# EAGLE schematic tinynumitronboard-extended (EAGLE 6.3)
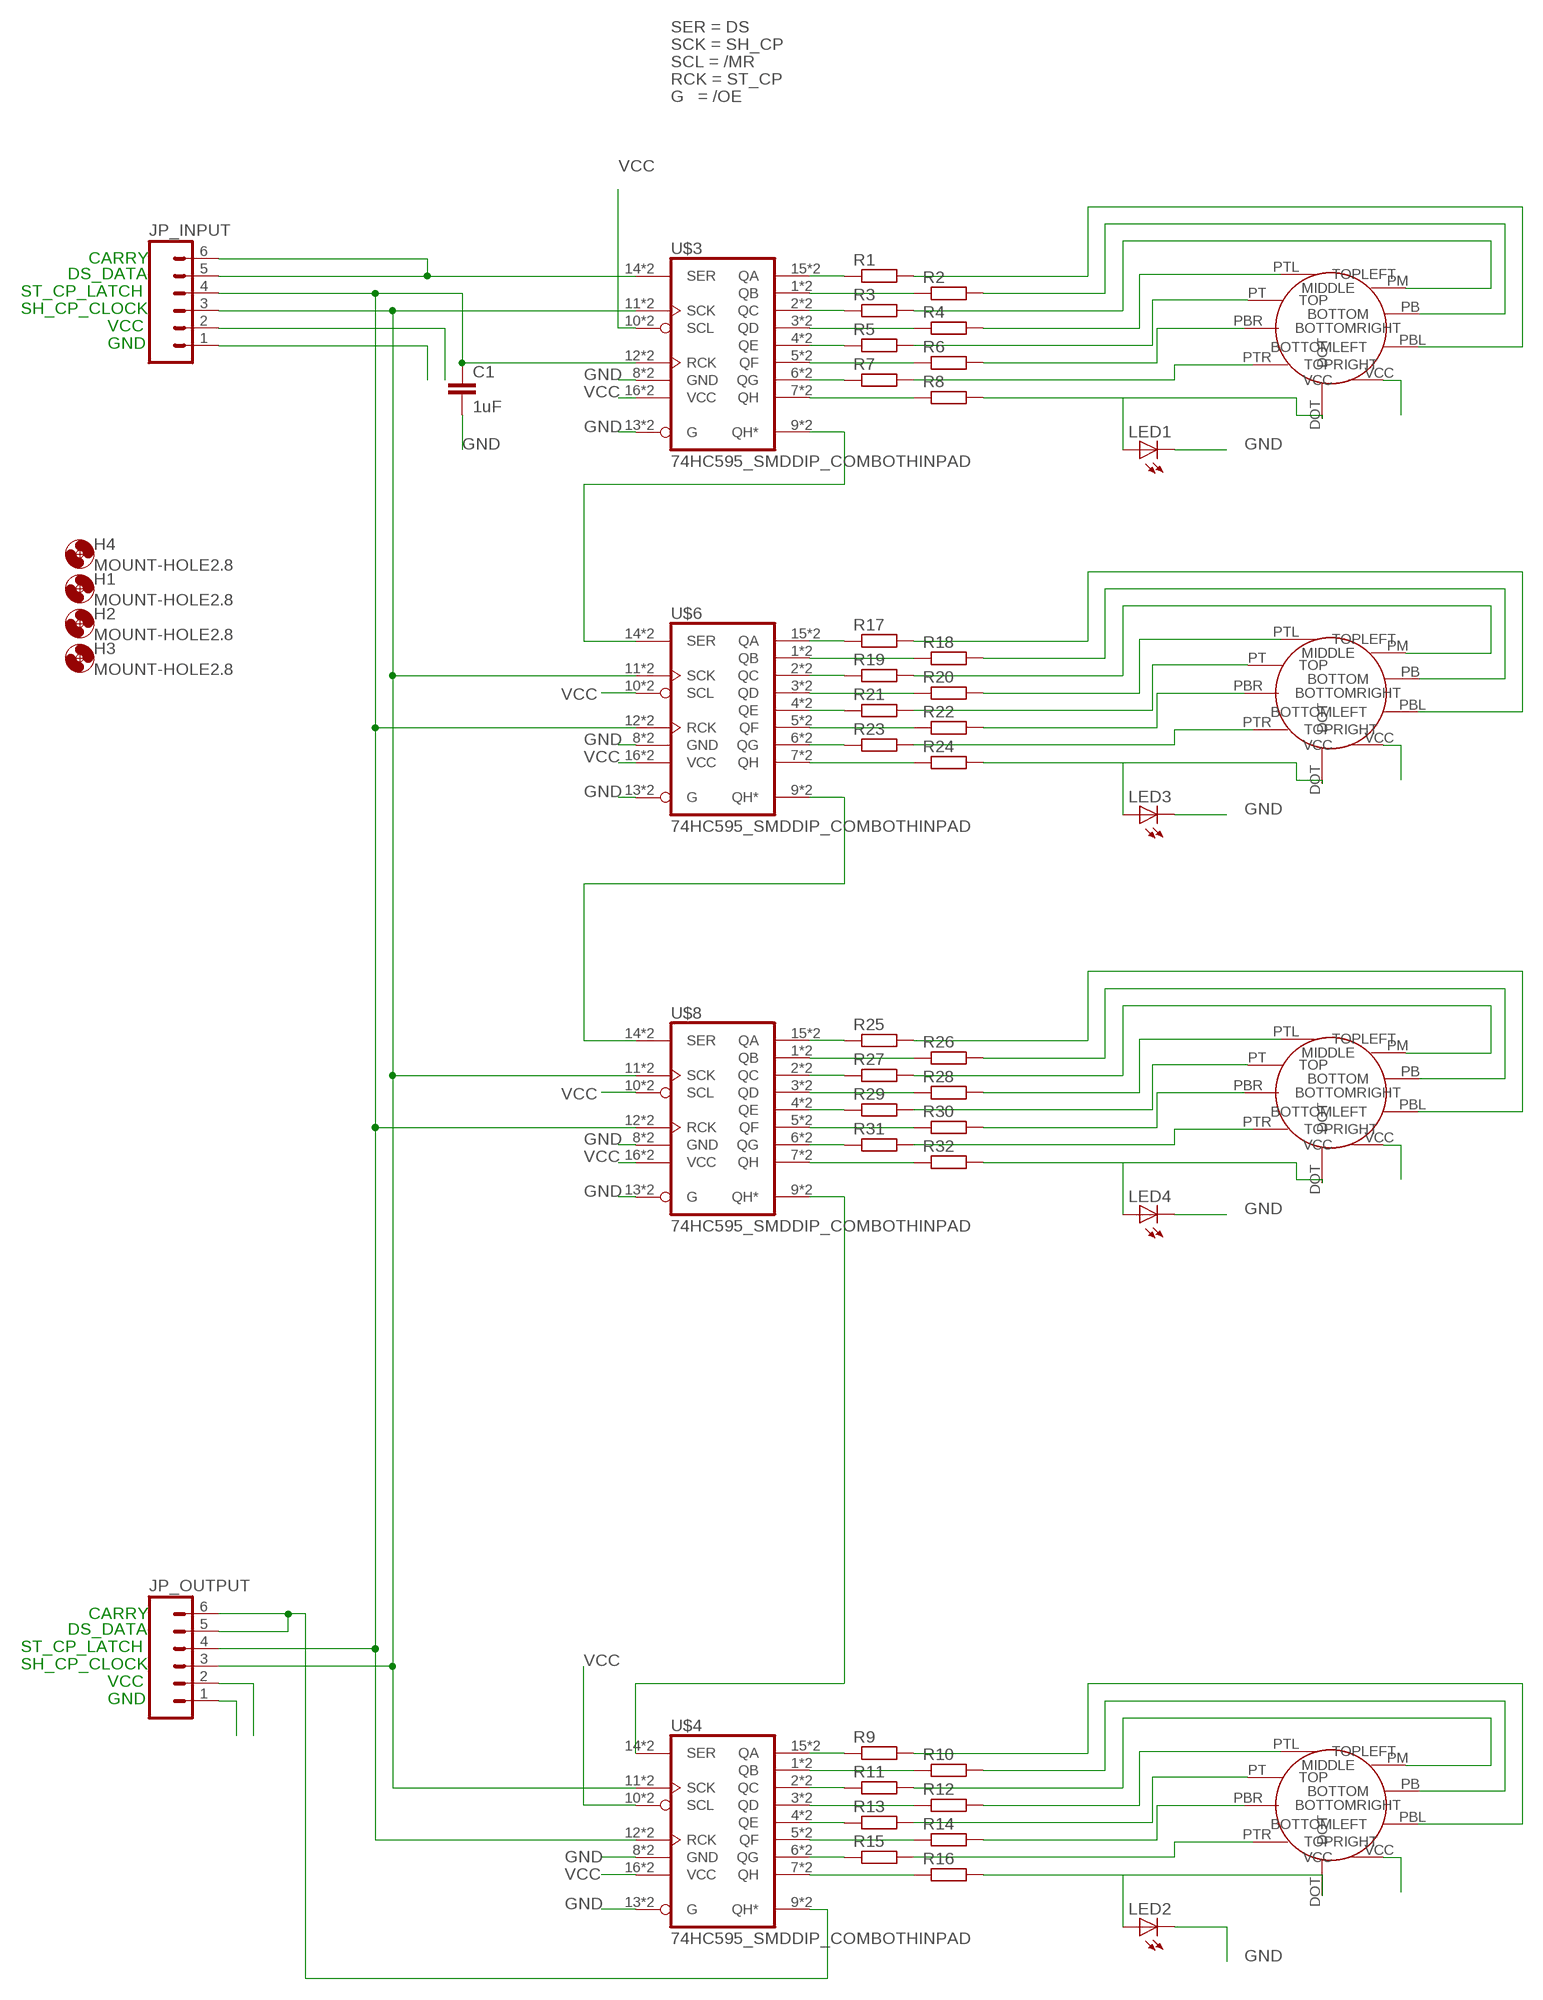
[diagram p0: schematic, sheet 1]

## Parts
C1  1uF  C-EU050-024X044  [C050-024X044]
H1  MOUNT-HOLE2.8  [2,8]
H2  MOUNT-HOLE2.8  [2,8]
H3  MOUNT-HOLE2.8  [2,8]
H4  MOUNT-HOLE2.8  [2,8]
JP_INPUT  M06SIP  [1X06]
JP_OUTPUT  M06SIP  [1X06]
LED1  LEDKA-3528ASYC  [KA-3528ASYC]
LED2  LEDKA-3528ASYC  [KA-3528ASYC]
LED3  LEDKA-3528ASYC  [KA-3528ASYC]
LED4  LEDKA-3528ASYC  [KA-3528ASYC]
R1  R-EU_0207/10  [0207/10]
R2  R-EU_0207/10  [0207/10]
R3  R-EU_0207/10  [0207/10]
R4  R-EU_0207/10  [0207/10]
R5  R-EU_0207/10  [0207/10]
R6  R-EU_0207/10  [0207/10]
R7  R-EU_0207/10  [0207/10]
R8  R-EU_0207/10  [0207/10]
R9  R-EU_0207/10  [0207/10]
R10  R-EU_0207/10  [0207/10]
R11  R-EU_0207/10  [0207/10]
R12  R-EU_0207/10  [0207/10]
R13  R-EU_0207/10  [0207/10]
R14  R-EU_0207/10  [0207/10]
R15  R-EU_0207/10  [0207/10]
R16  R-EU_0207/10  [0207/10]
R17  R-EU_0207/10  [0207/10]
R18  R-EU_0207/10  [0207/10]
R19  R-EU_0207/10  [0207/10]
R20  R-EU_0207/10  [0207/10]
R21  R-EU_0207/10  [0207/10]
R22  R-EU_0207/10  [0207/10]
R23  R-EU_0207/10  [0207/10]
R24  R-EU_0207/10  [0207/10]
R25  R-EU_0207/10  [0207/10]
R26  R-EU_0207/10  [0207/10]
R27  R-EU_0207/10  [0207/10]
R28  R-EU_0207/10  [0207/10]
R29  R-EU_0207/10  [0207/10]
R30  R-EU_0207/10  [0207/10]
R31  R-EU_0207/10  [0207/10]
R32  R-EU_0207/10  [0207/10]
U$1  IV16TINY_NUMITRON  [IV16TINY_NUMITRON_PAC]
U$2  IV16TINY_NUMITRON  [IV16TINY_NUMITRON_PAC]
U$3  74HC595_SMDDIP_COMBOTHINPAD  [DIL16_SO16_PAC2]
U$4  74HC595_SMDDIP_COMBOTHINPAD  [DIL16_SO16_PAC2]
U$5  IV16TINY_NUMITRON  [IV16TINY_NUMITRON_PAC]
U$6  74HC595_SMDDIP_COMBOTHINPAD  [DIL16_SO16_PAC2]
U$7  IV16TINY_NUMITRON  [IV16TINY_NUMITRON_PAC]
U$8  74HC595_SMDDIP_COMBOTHINPAD  [DIL16_SO16_PAC2]

## Nets
GND: C1.2 JP_INPUT.1 JP_OUTPUT.1 LED1.C LED2.C LED3.C LED4.C U$4.8(GND) U$4.13(G) U$4.S8(GND) U$4.S13(G)
N$1: R1.2 U$1.PBL(BOTTOMLEFT)
N$2: R2.2 U$1.PB(BOTTOM)
N$3: R3.2 U$1.PM(MIDDLE)
N$4: R4.2 U$1.PTL(TOPLEFT)
N$5: R5.2 U$1.PT(TOP)
N$6: R6.2 U$1.PBR(BOTTOMRIGHT)
N$7: R7.2 U$1.PTR(TOPRIGHT)
N$8: R1.1 U$3.15(QA) U$3.S15(QA)
N$9: R2.1 U$3.1(QB) U$3.S1(QB)
N$10: R3.1 U$3.2(QC) U$3.S2(QC)
N$11: R4.1 U$3.3(QD) U$3.S3(QD)
N$12: R5.1 U$3.4(QE) U$3.S4(QE)
N$13: R6.1 U$3.5(QF) U$3.S5(QF)
N$14: R7.1 U$3.6(QG) U$3.S6(QG)
N$15: JP_INPUT.5 JP_INPUT.6
N$16: R8.1 U$3.7(QH) U$3.S7(QH)
N$17: LED1.A R8.2 U$1.DOT
N$18: C1.1 JP_INPUT.4 JP_OUTPUT.4 U$4.12(RCK) U$4.S12(RCK)
N$19: JP_INPUT.3 JP_OUTPUT.3 U$4.11(SCK) U$4.S11(SCK)
N$20: R9.2 U$2.PBL(BOTTOMLEFT)
N$21: R10.2 U$2.PB(BOTTOM)
N$22: JP_OUTPUT.5 JP_OUTPUT.6 U$4.9(QH*) U$4.S9(QH*)
N$24: R11.2 U$2.PM(MIDDLE)
N$25: R12.2 U$2.PTL(TOPLEFT)
N$26: R13.2 U$2.PT(TOP)
N$27: R14.2 U$2.PBR(BOTTOMRIGHT)
N$28: R15.2 U$2.PTR(TOPRIGHT)
N$29: R9.1 U$4.15(QA) U$4.S15(QA)
N$30: R10.1 U$4.1(QB) U$4.S1(QB)
N$31: R11.1 U$4.2(QC) U$4.S2(QC)
N$32: R12.1 U$4.3(QD) U$4.S3(QD)
N$33: R13.1 U$4.4(QE) U$4.S4(QE)
N$34: R14.1 U$4.5(QF) U$4.S5(QF)
N$35: R15.1 U$4.6(QG) U$4.S6(QG)
N$36: R16.1 U$4.7(QH) U$4.S7(QH)
N$37: LED2.A R16.2 U$2.DOT
N$39: R17.2 U$5.PBL(BOTTOMLEFT)
N$40: R18.2 U$5.PB(BOTTOM)
N$41: R19.2 U$5.PM(MIDDLE)
N$42: R20.2 U$5.PTL(TOPLEFT)
N$43: R21.2 U$5.PT(TOP)
N$44: R22.2 U$5.PBR(BOTTOMRIGHT)
N$45: R23.2 U$5.PTR(TOPRIGHT)
N$46: R17.1 U$6.15(QA) U$6.S15(QA)
N$47: R18.1 U$6.1(QB) U$6.S1(QB)
N$48: R19.1 U$6.2(QC) U$6.S2(QC)
N$49: R20.1 U$6.3(QD) U$6.S3(QD)
N$50: R21.1 U$6.4(QE) U$6.S4(QE)
N$51: R22.1 U$6.5(QF) U$6.S5(QF)
N$52: R23.1 U$6.6(QG) U$6.S6(QG)
N$53: R24.1 U$6.7(QH) U$6.S7(QH)
N$54: LED3.A R24.2 U$5.DOT
N$62: R25.2 U$7.PBL(BOTTOMLEFT)
N$63: R26.2 U$7.PB(BOTTOM)
N$64: R27.2 U$7.PM(MIDDLE)
N$65: R28.2 U$7.PTL(TOPLEFT)
N$66: R29.2 U$7.PT(TOP)
N$67: R30.2 U$7.PBR(BOTTOMRIGHT)
N$68: R31.2 U$7.PTR(TOPRIGHT)
N$69: R25.1 U$8.15(QA) U$8.S15(QA)
N$70: R26.1 U$8.1(QB) U$8.S1(QB)
N$71: R27.1 U$8.2(QC) U$8.S2(QC)
N$72: R28.1 U$8.3(QD) U$8.S3(QD)
N$73: R29.1 U$8.4(QE) U$8.S4(QE)
N$74: R30.1 U$8.5(QF) U$8.S5(QF)
N$75: R31.1 U$8.6(QG) U$8.S6(QG)
N$76: R32.1 U$8.7(QH) U$8.S7(QH)
N$77: LED4.A R32.2 U$7.DOT
N$78: U$4.14(SER) U$4.S14(SER)
VCC: JP_INPUT.2 JP_OUTPUT.2 U$1.VCC U$2.VCC U$4.10(SCL) U$4.16(VCC) U$4.S10(SCL) U$4.S16(VCC) U$5.VCC U$7.VCC
Unconnected: U$3.9(QH*) U$3.10(SCL) U$3.11(SCK) U$3.12(RCK) U$3.13(G) U$3.14(SER) U$3.S9(QH*) U$3.S10(SCL) U$3.S11(SCK) U$3.S12(RCK) U$3.S13(G) U$3.S14(SER) U$6.9(QH*) U$6.10(SCL) U$6.11(SCK) U$6.12(RCK) U$6.13(G) U$6.14(SER) U$6.S9(QH*) U$6.S10(SCL) U$6.S11(SCK) U$6.S12(RCK) U$6.S13(G) U$6.S14(SER) U$8.9(QH*) U$8.10(SCL) U$8.11(SCK) U$8.12(RCK) U$8.13(G) U$8.14(SER) U$8.S9(QH*) U$8.S10(SCL) U$8.S11(SCK) U$8.S12(RCK) U$8.S13(G) U$8.S14(SER)

## Notes on the sheet
- SER = DS
- SCK = SH_CP
- SCL = /MR
- RCK = ST_CP
- G   = /OE
- CARRY
- DS_DATA
- ST_CP_LATCH
- SH_CP_CLOCK
- VCC
- GND
- CARRY
- DS_DATA
- ST_CP_LATCH
- SH_CP_CLOCK
- VCC
- GND

## Power pins joined to a net without a drawn wire
GND: U$3.8(GND) U$3.S8(GND) U$6.8(GND) U$6.S8(GND) U$8.8(GND) U$8.S8(GND)
VCC: U$3.16(VCC) U$3.S16(VCC) U$6.16(VCC) U$6.S16(VCC) U$8.16(VCC) U$8.S16(VCC)

## Library data of the parts
C1 = resistor:C-EU: CAPACITOR, European symbol
H1-H4 = holes:MOUNT-HOLE: MOUNTING HOLE with drill center marker
JP_INPUT JP_OUTPUT = SparkFun:M06: Header 6 Standard 6-pin 0.1" header. Use with straight break away headers (SKU : PRT-00116), right angle break away headers (PRT-00553), swiss pins (PRT-00743), machine pins (PRT-00117), and female headers (PRT-00115). Molex polarized connector foot print use with SKU : PRT-08094 with associated crimp pins and housings. NOTES ON THE VARIANTS LOCK and LOCK_LONGPADS... This footprint was designed to help hold the alignment of a through-hole component (i.e. 6-pin header) while soldering it into place. You may notice that each hole has been shifted either up or down by 0.005 of an inch from it's more standard position (which is a perfectly straight line). This slight alteration caused the pins (the squares in the middle) to touch the edges of the holes. Because they are alternating, it causes a "brace" to hold the component in place. 0.005 has proven to be the perfect amount of "off-center" position when using our standard breakaway headers. Although looks a little odd when you look at the bare footprint, once you have a header in there, the alteration is very hard to notice. Also, if you push a header all the way into place, it is covered up entirely on the bottom side. This idea of altering the position of holes to aid alignment will be further integrated into the Sparkfun Library for other footprints. It can help hold any component with 3 or more connection pins.
LED1-LED4 = led:LED: LED OSRAM: - CHIPLED LG R971, LG N971, LY N971, LG Q971, LY Q971, LO R971, LY R971 LH N974, LH R974 LS Q976, LO Q976, LY Q976 LO Q996 - Hyper CHIPLED LW Q18S LB Q993, LB Q99A, LB R99A - SideLED LS A670, LO A670, LY A670, LG A670, LP A670 LB A673, LV A673, LT A673, LW A673 LH A674 LY A675 LS A676, LA A676, LO A676, LY A676, LW A676 LS A679, LY A679, LG A679 - Hyper Micro SIDELED® LS Y876, LA Y876, LO Y876, LY Y876 LT Y87S - SmartLED LW L88C, LW L88S LB L89C, LB L89S, LG L890 LS L89K, LO L89K, LY L89K LS L896, LA L896, LO L896, LY L896 - TOPLED LS T670, LO T670, LY T670, LG T670, LP T670 LSG T670, LSP T670, LSY T670, LOP T670, LYG T670 LG T671, LOG T671, LSG T671 LB T673, LV T673, LT T673, LW T673 LH T674 LS T676, LA T676, LO T676, LY T676, LB T676, LH T676, LSB T676, LW T676 LB T67C, LV T67C, LT T67C, LS T67K, LO T67K, LY T67K, LW E67C LS E67B, LA E67B, LO E67B, LY E67B, LB E67C, LV E67C, LT E67C LW T67C LS T679, LY T679, LG T679 LS T770, LO T770, LY T770, LG T770, LP T770 LB T773, LV T773, LT T773, LW T773 LH T774 LS E675, LA E675, LY E675, LS T675 LS T776, LA T776, LO T776, LY T776, LB T776 LHGB T686 LT T68C, LB T68C - Hyper Mini TOPLED® LB M676 - Mini TOPLED Santana® LG M470 LS M47K, LO M47K, LY M47K Source: http://www.osram.convergy.de LUXEON: - LUMILED® LXK2-PW12-R00, LXK2-PW12-S00, LXK2-PW14-U00, LXK2-PW14-V00 LXK2-PM12-R00, LXK2-PM12-S00, LXK2-PM14-U00 LXK2-PE12-Q00, LXK2-PE12-R00, LXK2-PE12-S00, LXK2-PE14-T00, LXK2-PE14-U00 LXK2-PB12-K00, LXK2-PB12-L00, LXK2-PB12-M00, LXK2-PB14-N00, LXK2-PB14-P00, LXK2-PB14-Q00 LXK2-PR12-L00, LXK2-PR12-M00, LXK2-PR14-Q00, LXK2-PR14-R00 LXK2-PD12-Q00, LXK2-PD12-R00, LXK2-PD12-S00 LXK2-PH12-R00, LXK2-PH12-S00 LXK2-PL12-P00, LXK2-PL12-Q00, LXK2-PL12-R00 Source: www.luxeon.com KINGBRIGHT: KA-3528ASYC Source: www.kingbright.com
R1-R32 = resistor:R-EU_: RESISTOR, European symbol
U$1 U$2 U$5 U$7 = kalshagar:IV16TINY_NUMITRON
U$3 U$4 U$6 U$8 = kalshagar:74HC595_SMDDIP_COMBO